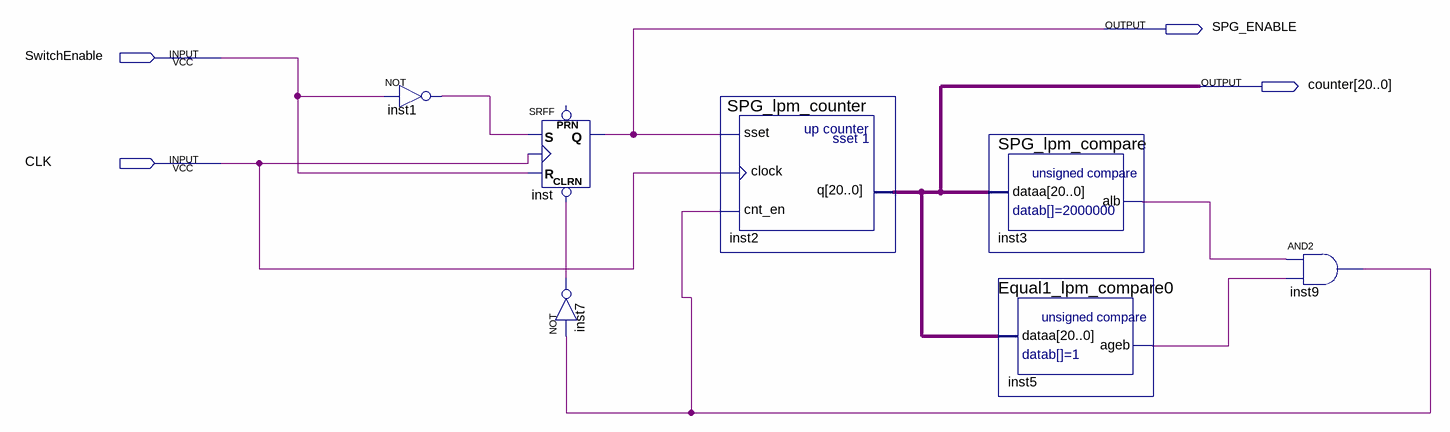
[diagram p0: schematic sheet]
// Quartus schematic g21_SPG.bdf as structural Verilog: 7 symbols, 4 pins
module g21_SPG (
  input  SwitchEnable,
  input  CLK,
  output SPG_ENABLE,
  output [20:0] counter
);

  wire inst1_out, inst3_alb, inst5_ageb, inst7_out, inst9_out;

  not inst1 (inst1_out, SwitchEnable);
  SRFF inst (.CLRN(inst7_out), .S(inst1_out), .R(SwitchEnable), .CLK(CLK), .Q(SPG_ENABLE));  // open: PRN
  not inst7 (inst7_out, inst9_out);
  SPG_lpm_counter inst2 (.sset(SPG_ENABLE), .clock(CLK), .cnt_en(inst9_out), .q(counter));
  SPG_lpm_compare inst3 (.dataa(counter), .alb(inst3_alb));
  Equal1_lpm_compare0 inst5 (.dataa(counter), .ageb(inst5_ageb));
  and inst9 (inst9_out, inst3_alb, inst5_ageb);
endmodule
